# EAGLE design Test2 (EAGLE 7.6.0)
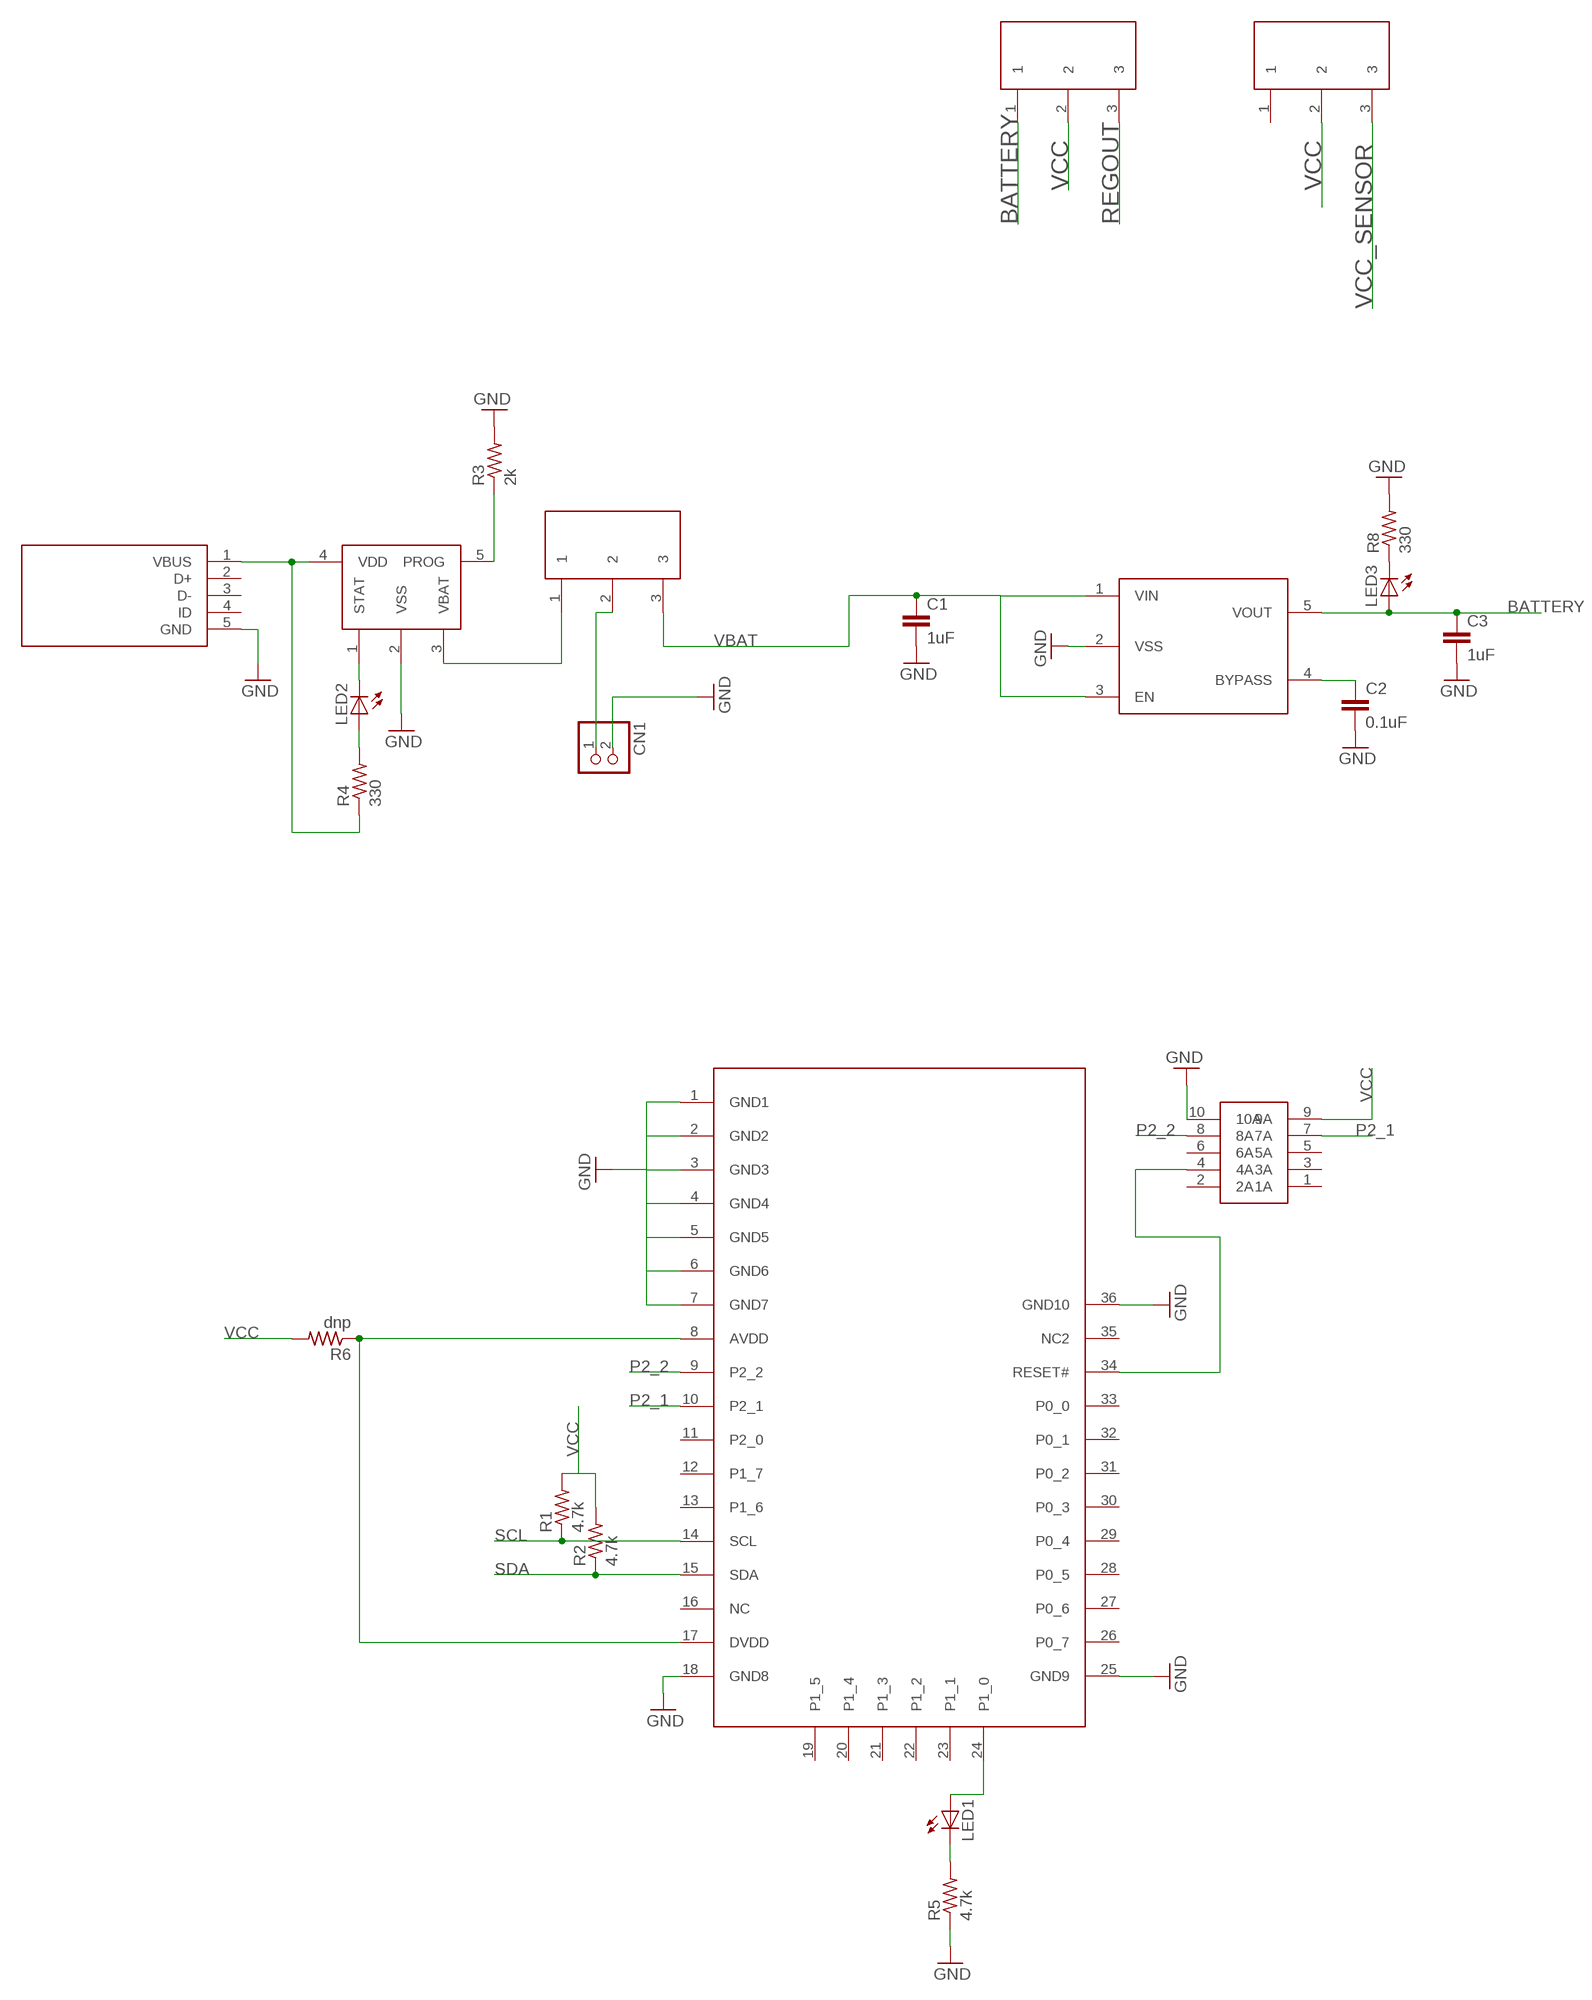
[diagram p0: schematic, sheet 1, part 1 of 2]
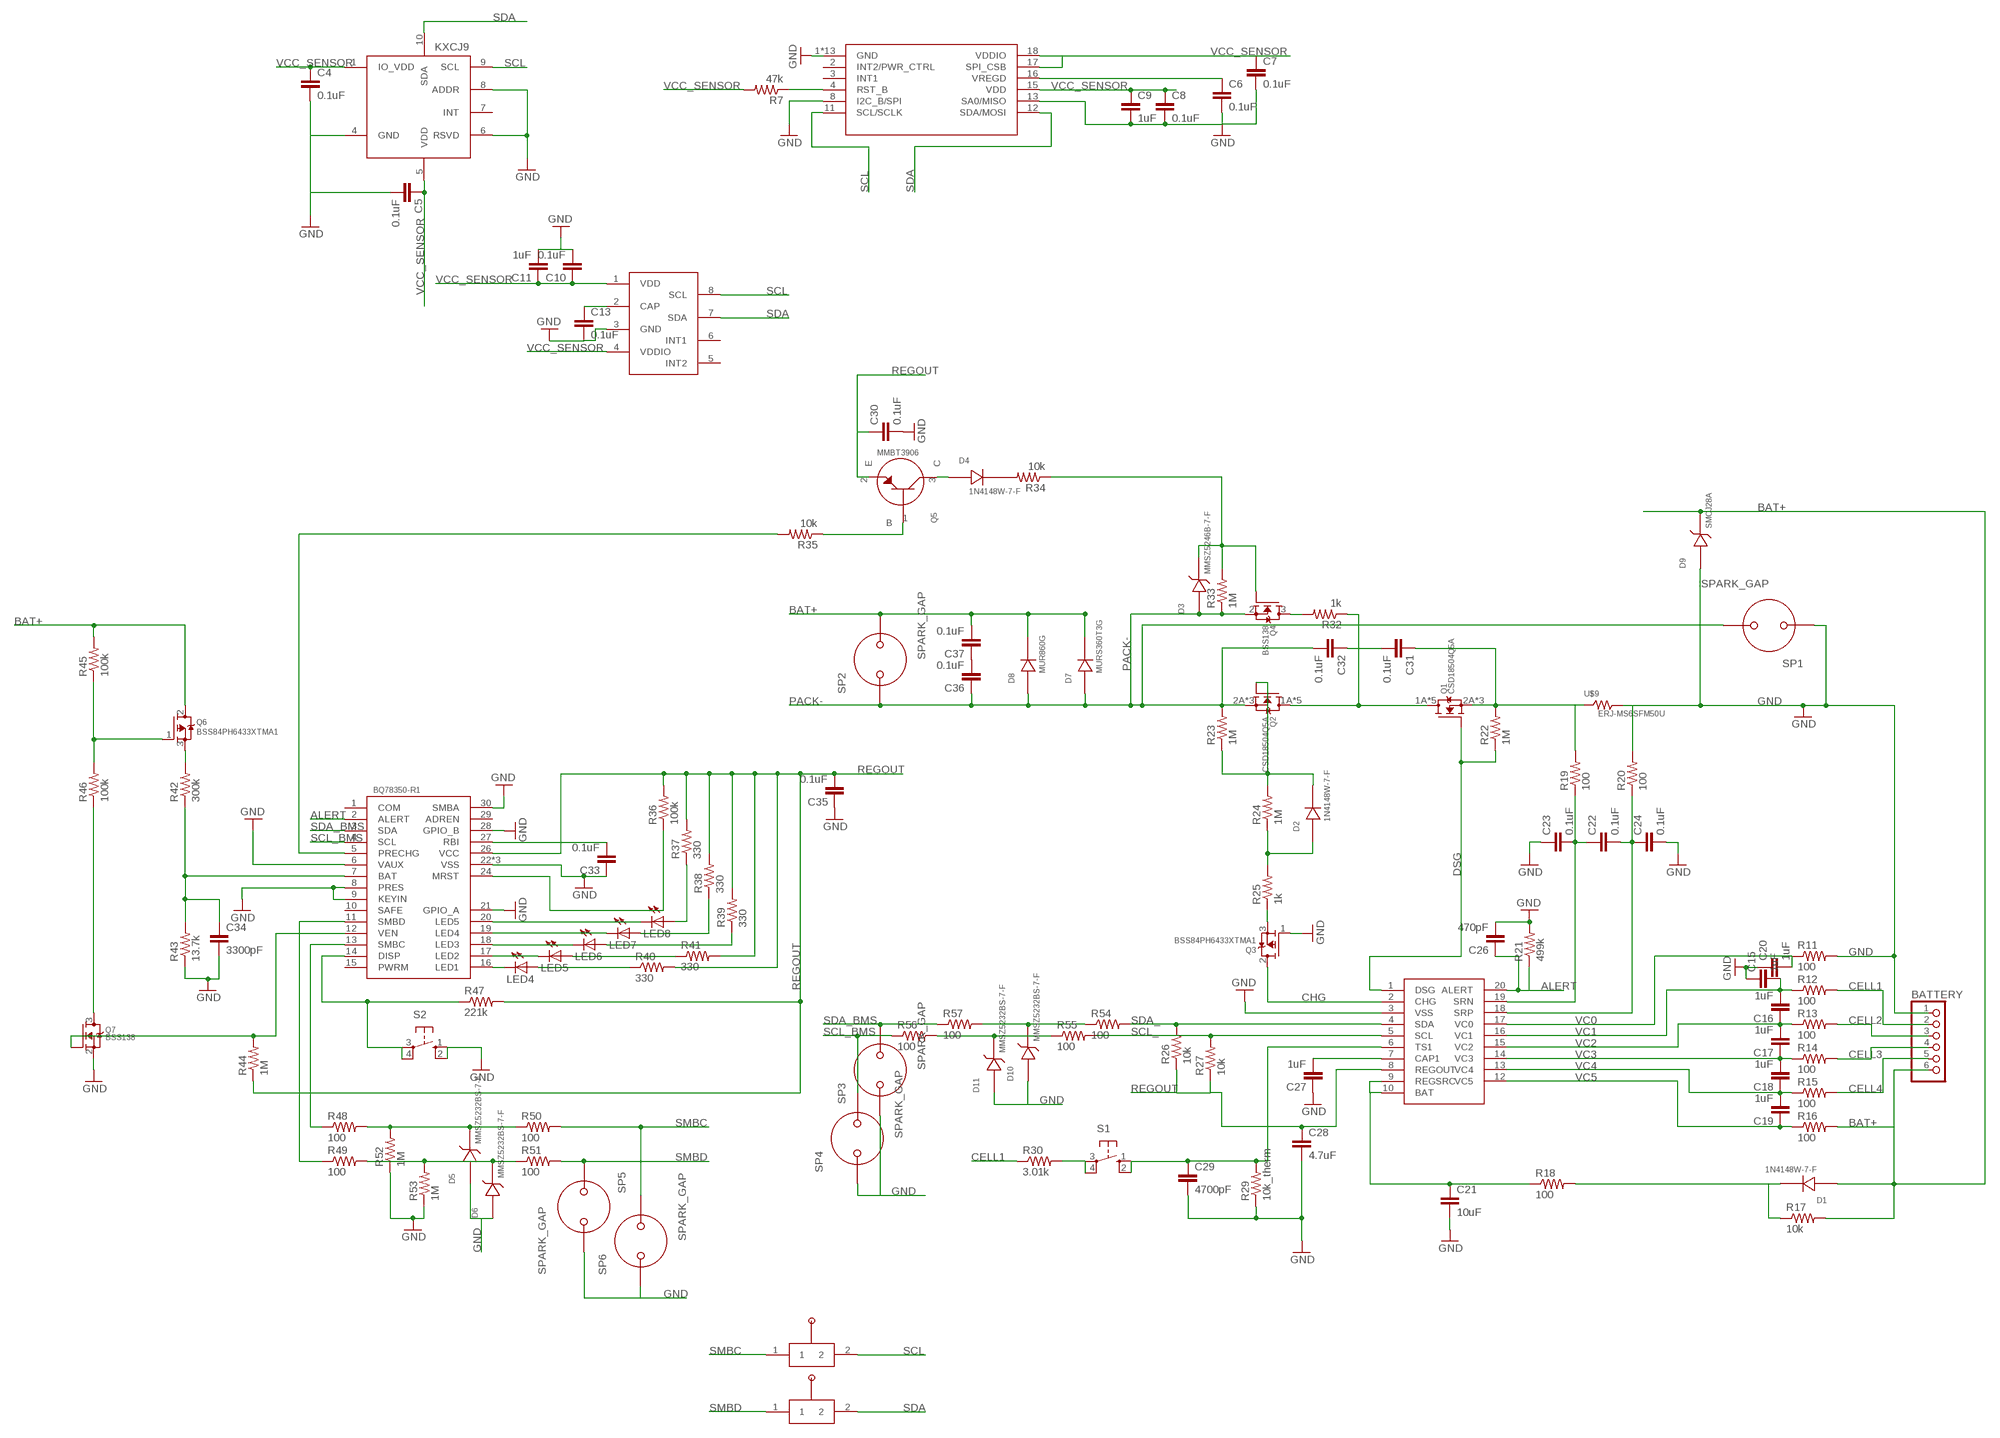
[diagram p1: schematic, sheet 1, part 2 of 2]

## Parts
BATTERY  PINHD-1X6  [1X06]
C1  1uF  C-EUC0402  [C0402]
C2  0.1uF  C-EUC0402  [C0402]
C3  1uF  C-EUC0402  [C0402]
C4  0.1uF  C-EUC0402  [C0402]
C5  0.1uF  C-EUC0402  [C0402]
C6  0.1uF  C-EUC0402  [C0402]
C7  0.1uF  C-EUC0402  [C0402]
C8  0.1uF  C-EUC0402  [C0402]
C9  1uF  C-EUC0402  [C0402]
C10  0.1uF  C-EUC0402  [C0402]
C11  1uF  C-EUC0402  [C0402]
C13  0.1uF  C-EUC0402  [C0402]
C15  1uF  C-EUC0805  [C0805]
C16  1uF  C-EUC0805  [C0805]
C17  1uF  C-EUC0805  [C0805]
C18  1uF  C-EUC0805  [C0805]
C19  1uF  C-EUC0805  [C0805]
C20  1uF  C-EUC0805  [C0805]
C21  10uF  C-EUC1206  [C1206]
C22  0.1uF  C-EUC0805  [C0805]
C23  0.1uF  C-EUC0805  [C0805]
C24  0.1uF  C-EUC0805  [C0805]
C26  470pF  C-EUC0805  [C0805]
C27  1uF  C-EUC0805  [C0805]
C28  4.7uF  C-EUC0805  [C0805]
C29  4700pF  C-EUC0402  [C0402]
C30  0.1uF  C-EUC0805  [C0805]
C31  0.1uF  C-EUC0805  [C0805]
C32  0.1uF  C-EUC0805  [C0805]
C33  0.1uF  C-EUC0805  [C0805]
C34  3300pF  C-EUC0402  [C0402]
C35  0.1uF  C-EUC0805  [C0805]
C36  0.1uF  C-EUC0805  [C0805]
C37  0.1uF  C-EUC0805  [C0805]
CN1  JST_2PIN-SMT-RA  [JST-PH-2-SMT-RA]
D1  1N4148W-7-F  [SOD-123]
D2  1N4148W-7-F  [SOD-123]
D3  MMSZ5246B-7-F  [SOD-123]
D4  1N4148W-7-F  [SOD-123]
D5  MMSZ5232BS-7-F  [SOD-323F]
D6  MMSZ5232BS-7-F  [SOD-323F]
D7  MURS360T3G  [SMC(DO-214AB)]
D8  MUR860G  [TO-220(2RA)]
D9  SMCJ28A  [SMC(DO-214AB)]
D10  MMSZ5232BS-7-F  [SOD-323F]
D11  MMSZ5232BS-7-F  [SOD-323F]
LED1  LEDCHIP-LED0805  [CHIP-LED0805]
LED2  LEDCHIP-LED0805  [CHIP-LED0805]
LED3  LEDCHIP-LED0805  [CHIP-LED0805]
LED4  LEDCHIPLED_0805  [CHIPLED_0805]
LED5  LEDCHIPLED_0805  [CHIPLED_0805]
LED6  LEDCHIPLED_0805  [CHIPLED_0805]
LED7  LEDCHIPLED_0805  [CHIPLED_0805]
LED8  LEDCHIPLED_0805  [CHIPLED_0805]
Q1  CSD18504Q5A  [Q5A]
Q2  CSD18504Q5A  [Q5A]
Q3  BSS84PH6433XTMA1  [SOT23-3]
Q4  BSS138  [SOT23-3]
Q5  MMBT3906  [SOT23-3]
Q6  BSS84PH6433XTMA1  [SOT23-3]
Q7  BSS138  [SOT23-3]
R1  4.7k  R-US_R0402  [R0402]
R2  4.7k  R-US_R0402  [R0402]
R3  2k  R-US_R0402  [R0402]
R4  330  R-US_R0402  [R0402]
R5  4.7k  R-US_R0402  [R0402]
R6  dnp  R-US_R0402  [R0402]
R7  47k  R-US_R0402  [R0402]
R8  330  R-US_R0402  [R0402]
R11  100  R-US_R1206  [R1206]
R12  100  R-US_R1206  [R1206]
R13  100  R-US_R1206  [R1206]
R14  100  R-US_R1206  [R1206]
R15  100  R-US_R1206  [R1206]
R16  100  R-US_R1206  [R1206]
R17  10k  R-US_R0805  [R0805]
R18  100  R-US_R0805  [R0805]
R19  100  R-US_R0805  [R0805]
R20  100  R-US_R0805  [R0805]
R21  499k  R-US_R0805  [R0805]
R22  1M  R-US_R1206  [R1206]
R23  1M  R-US_R1206  [R1206]
R24  1M  R-US_R1206  [R1206]
R25  1k  R-US_R0805  [R0805]
R26  10k  R-US_R0805  [R0805]
R27  10k  R-US_R0805  [R0805]
R29  10k_therm  R-US_R0402  [R0402]
R30  3.01k  R-US_R0805  [R0805]
R32  1k  R-US_R2512  [R2512]
R33  1M  R-US_R1206  [R1206]
R34  10k  R-US_R0805  [R0805]
R35  10k  R-US_R0805  [R0805]
R36  100k  R-US_R0805  [R0805]
R37  330  R-US_R0402  [R0402]
R38  330  R-US_R0402  [R0402]
R39  330  R-US_R0402  [R0402]
R40  330  R-US_R0402  [R0402]
R41  330  R-US_R0402  [R0402]
R42  300k  R-US_R0805  [R0805]
R43  13.7k  R-US_R0805  [R0805]
R44  1M  R-US_R1206  [R1206]
R45  100k  R-US_R0805  [R0805]
R46  100k  R-US_R0805  [R0805]
R47  221k  R-US_R0805  [R0805]
R48  100  R-US_R0805  [R0805]
R49  100  R-US_R0805  [R0805]
R50  100  R-US_R0805  [R0805]
R51  100  R-US_R0805  [R0805]
R52  1M  R-US_R1206  [R1206]
R53  1M  R-US_R1206  [R1206]
R54  100  R-US_R0805  [R0805]
R55  100  R-US_R0805  [R0805]
R56  100  R-US_R0805  [R0805]
R57  100  R-US_R0805  [R0805]
S1  10-XX  [B3F-10XX]
S2  10-XX  [B3F-10XX]
SP1  SPARK_GAP  [SPARK_GAP]
SP2  SPARK_GAP  [SPARK_GAP]
SP3  SPARK_GAP  [SPARK_GAP]
SP4  SPARK_GAP  [SPARK_GAP]
SP5  SPARK_GAP  [SPARK_GAP]
SP6  SPARK_GAP  [SPARK_GAP]
U$1  BQ76920  [SOIC-20]
U$2  BLE113  [BLUEGIGA]
U$3  RIBBON_10POS_MALE  [RIBBON_10POS_MALE]
U$4  LP3985  [SOT23-5L]
U$5  SPDT_THRU  [SPDT_THRU]
U$6  USB_MINI  [USB_MINI]
U$7  KXCJ9  [KXCJ9]
U$8  FXAS21002  [FXAS21002]
U$9  ERJ-MS6SFM50U  [ERJ-MS6SFM50U]
U$10  BQ78350-R1  [SOIC-30]
U$11  SPDT_THRU  [SPDT_THRU]
U$12  SPDT_THRU  [SPDT_THRU]
U$13  MCP73831  [MCP73831]
U$14  MLP3115A2  [MLP3115A2]
U$16  MANUAL_SWITCH  [MANUAL_SWITCH]
U$17  MANUAL_SWITCH  [MANUAL_SWITCH]

## Nets
ALERT: C26.1 R21.1 U$1.20(ALERT) U$10.2(ALERT)
BAT+: BATTERY.6 C37.2 D1.P$1 D7.2 D8.P$3 D9.2 Q6.2(S) R16.2 R17.2 R45.2 SP2.P$2
BATTERY: C3.1 LED3.A U$4.5(VOUT) U$11.1
CELL1: BATTERY.2 R12.2 R30.1
CELL2: BATTERY.3 R13.2
CELL3: BATTERY.4 R14.2
CELL4: BATTERY.5 R15.2
CHG: Q3.2(S) U$1.2(CHG)
DSG: Q1.3A(G) R22.1 U$1.1(DSG)
GND: BATTERY.1 C1.2 C2.2 C3.2 C4.2 C5.2 C6.2 C7.2 C8.2 C9.2 C10.2 C11.2 C13.2 C15.1 C20.1 C21.2 C23.1 C24.2 C26.2 C27.1 C28.2 C29.2 C30.2 C33.1 C34.2 C35.1 CN1.2 D5.1 D6.1 D9.1 D10.1 D11.1 Q3.1(G) Q7.2(S) R3.2 R5.1 R8.2 R11.2 R20.2 R21.2 R29.1 R43.1 R52.1 R53.1 S2.1(S) S2.2(S1) SP1.P$1 SP3.P$1 SP4.P$1 SP5.P$2 SP6.P$1 U$1.3(VSS) U$2.1(GND1) U$2.2(GND2) U$2.3(GND3) U$2.4(GND4) U$2.5(GND5) U$2.6(GND6) U$2.7(GND7) U$2.18(GND8) U$2.25(GND9) U$2.36(GND10) U$3.10(10A) U$4.2(VSS) U$6.5(GND) U$7.4(GND) U$7.6(RSVD) U$7.8(ADDR) U$8.1(GND) U$8.5(GND) U$8.6(GND) U$8.7(GND) U$8.8(I2C_B/SPI) U$8.9(GND) U$8.10(GND) U$8.13(SA0/MISO) U$8.14(GND) U$8.19(GND) U$8.20(GND) U$8.21(GND) U$8.22(GND) U$8.23(GND) U$8.24(GND) U$9.2 U$10.6(VAUX) U$10.8(PRES) U$10.9(KEYIN) U$10.21(GPIO_A) U$10.22(VSS) U$10.23(VSS) U$10.25(VSS) U$10.28(GPIO_B) U$10.30(SMBA) U$13.2(VSS) U$14.3(GND)
N$2: R6.1 U$2.8(AVDD) U$2.17(DVDD)
N$3: CN1.1 U$5.2
N$4: U$2.34(RESET#) U$3.4(4A)
N$5: R3.1 U$13.5(PROG)
N$6: U$5.1 U$13.3(VBAT)
N$7: LED2.A R4.2
N$8: LED2.C U$13.1(STAT)
N$9: LED1.C R5.2
N$10: LED1.A U$2.24(P1_0)
N$11: C2.1 U$4.4(BYPASS)
N$12: C6.1 U$8.16(VREGD)
N$13: C13.1 U$14.2(CAP)
N$14: LED3.C R8.1
N$15: C21.1 R18.1 U$1.9(REGSRC) U$1.10(BAT)
N$16: C22.2 C24.1 R20.1 U$1.18(SRP)
N$17: D1.P$2 R17.1 R18.2
N$18: D11.2 R55.1 R56.2
N$19: C31.1 Q1.2A(S) Q1.2B(S) Q1.2C(S) R19.2 R22.2 U$9.1
N$20: C22.1 C23.2 R19.1 U$1.19(SRN)
N$21: C27.2 U$1.7(CAP1)
N$22: Q4.3(D) R32.2
N$23: D4.P$2 R34.2
N$24: D3.P$2 Q4.1(G) R33.2 R34.1
N$25: D4.P$1 Q5.3(C)
N$27: D2.P$1 R24.1 R25.2
N$28: Q1.1A(D) Q1.1B(D) Q1.1C(D) Q1.1D(D) Q1.1E(D) Q2.1A(D) Q2.1B(D) Q2.1C(D) Q2.1D(D) Q2.1E(D) R32.1
N$29: C36.2 C37.1
N$30: D2.P$2 Q2.3A(G) R23.1 R24.2
N$31: Q3.3(D) R25.1
N$32: R30.2 S1.3(P) S1.4(P1)
N$33: C29.1 R29.2 S1.1(S) S1.2(S1) U$1.6(TS1)
N$34: Q5.1(B) R35.1
N$35: C31.2 C32.1
N$36: C33.2 U$10.27(RBI)
N$37: R35.2 U$10.5(PRECHG)
N$38: R36.1 U$10.24(MRST)
N$39: Q7.3(D) R46.1
N$40: LED8.C U$10.20(LED5)
N$41: LED7.C U$10.19(LED4)
N$42: LED6.C U$10.18(LED3)
N$43: LED5.C U$10.17(LED2)
N$44: LED4.C U$10.16(LED1)
N$45: LED4.A R40.1
N$46: LED5.A R41.1
N$47: LED6.A R39.1
N$48: LED7.A R38.1
N$49: LED8.A R37.1
N$50: C34.1 R42.1 R43.2 U$10.7(BAT)
N$51: Q7.1(G) R44.2 U$10.12(VEN)
N$52: Q6.3(D) R42.2
N$53: Q6.1(G) R45.1 R46.2
N$54: R48.1 U$10.13(SMBC)
N$55: R47.1 S2.3(P) S2.4(P1) U$10.14(DISP)
N$56: R49.1 U$10.11(SMBD)
N$57: D5.2 R48.2 R50.1 R52.2
N$58: D6.2 R49.2 R51.1 R53.2
N$59: D10.2 R54.1 R57.2
P2_1: U$2.10(P2_1) U$3.7(7A)
P2_2: U$2.9(P2_2) U$3.8(8A)
PACK-: C32.2 C36.1 D3.P$1 D7.1 D8.P$1 D8.P$4 Q2.2A(S) Q2.2B(S) Q2.2C(S) Q4.2(S) R23.2 R33.1 SP1.P$2 SP2.P$1
REGOUT: C28.1 C30.1 C35.2 Q5.2(E) R26.1 R27.1 R36.2 R37.2 R38.2 R39.2 R40.2 R41.2 R44.1 R47.2 U$1.8(REGOUT) U$10.26(VCC) U$11.3
RST_B: R7.1 U$8.4(RST_B)
SCL: R1.1 U$2.14(SCL) U$7.9(SCL) U$8.11(SCL/SCLK) U$14.8(SCL) U$16.2
SCL_: R27.2 R55.2 U$1.5(SCL)
SCL_BMS: R56.1 SP4.P$2 U$10.4(SCL)
SDA: R2.1 U$2.15(SDA) U$7.10(SDA) U$8.12(SDA/MOSI) U$14.7(SDA) U$17.2
SDA_: R26.2 R54.2 U$1.4(SDA)
SDA_BMS: R57.1 SP3.P$2 U$10.3(SDA)
SMBC: R50.2 SP6.P$2 U$16.1
SMBD: R51.2 SP5.P$1 U$17.1
VBAT: C1.1 U$4.1(VIN) U$4.3(EN) U$5.3
VBUS: R4.1 U$6.1(VBUS) U$13.4(VDD)
VC0: C20.2 R11.1 U$1.17(VC0)
VC1: C15.2 C16.2 R12.1 U$1.16(VC1)
VC2: C16.1 C17.2 R13.1 U$1.15(VC2)
VC3: C17.1 C18.2 R14.1 U$1.14(VC3)
VC4: C18.1 C19.2 R15.1 U$1.13(VC4)
VC5: C19.1 R16.1 U$1.12(VC5)
VCC: R1.2 R2.2 R6.2 U$3.9(9A) U$11.2 U$12.2
VCC_SENSOR: C4.1 C5.1 C7.1 C8.1 C9.1 C10.1 C11.1 R7.2 U$7.1(IO_VDD) U$7.5(VDD) U$8.15(VDD) U$8.17(SPI_CSB) U$8.18(VDDIO) U$12.3 U$14.1(VDD) U$14.4(VDDIO)
Unconnected: U$2.11(P2_0) U$2.12(P1_7) U$2.13(P1_6) U$2.16(NC) U$2.19(P1_5) U$2.20(P1_4) U$2.21(P1_3) U$2.22(P1_2) U$2.23(P1_1) U$2.26(P0_7) U$2.27(P0_6) U$2.28(P0_5) U$2.29(P0_4) U$2.30(P0_3) U$2.31(P0_2) U$2.32(P0_1) U$2.33(P0_0) U$2.35(NC2) U$3.1(1A) U$3.2(2A) U$3.3(3A) U$3.5(5A) U$3.6(6A) U$6.2(D+) U$6.3(D-) U$6.4(ID) U$7.7(INT) U$8.2(INT2/PWR_CTRL) U$8.3(INT1) U$10.1(COM) U$10.10(SAFE) U$10.15(PWRM) U$10.29(ADREN) U$12.1 U$14.5(INT2) U$14.6(INT1)

## Library data of the parts
BATTERY = adafruit:PINHD-1X6: PIN HEADER
C1-C11 C13 C15-C24 C26-C37 = rcl:C-EU: CAPACITOR, European symbol
CN1 = adafruit:JST_2PIN: JST 2-Pin Connectors of various flavors SMT-RA (S2B-PH-SM4) 4UConnector #17311 SMT (B2B-PH-SM4) THM-RA (S2B-PH) THM (B2B-PH)
D1 D2 D4 = Charles:1N4148W-7-F: DIODE GENERAL PURPOSE 100V 300MA
D3 = Charles:MMSZ5246B-7-F: ZENER DIODE 16V 500MW
D5 D6 D10 D11 = Charles:MMSZ5232BS-7-F: ZENER DIODE 5.6V 200MW
D7 = Charles:MURS360T3G: Ultrafast Power Rectifier, Diode General Purpose 600V 3A
D8 = Charles:MUR860G: DIODE GENERAL PURPOSE 600V 8A - SWITCH MODE POWER RECTIFIER
D9 = Charles:SMCJ28A: Zener Diode - 1500 Watt Transient Voltage Suppressor - 28VWM 45.4VC - Fairchild-Semiconductor
LED1-LED8 = adafruit:LED: LED OSRAM: - CHIPLED LG R971, LG N971, LY N971, LG Q971, LY Q971, LO R971, LY R971 LH N974, LH R974 LS Q976, LO Q976, LY Q976 LO Q996 - Hyper CHIPLED LW Q18S LB Q993, LB Q99A, LB R99A - SideLED LS A670, LO A670, LY A670, LG A670, LP A670 LB A673, LV A673, LT A673, LW A673 LH A674 LY A675 LS A676, LA A676, LO A676, LY A676, LW A676 LS A679, LY A679, LG A679 - Hyper Micro SIDELED® LS Y876, LA Y876, LO Y876, LY Y876 LT Y87S - SmartLED LW L88C, LW L88S LB L89C, LB L89S, LG L890 LS L89K, LO L89K, LY L89K LS L896, LA L896, LO L896, LY L896 - TOPLED LS T670, LO T670, LY T670, LG T670, LP T670 LSG T670, LSP T670, LSY T670, LOP T670, LYG T670 LG T671, LOG T671, LSG T671 LB T673, LV T673, LT T673, LW T673 LH T674 LS T676, LA T676, LO T676, LY T676, LB T676, LH T676, LSB T676, LW T676 LB T67C, LV T67C, LT T67C, LS T67K, LO T67K, LY T67K, LW E67C LS E67B, LA E67B, LO E67B, LY E67B, LB E67C, LV E67C, LT E67C LW T67C LS T679, LY T679, LG T679 LS T770, LO T770, LY T770, LG T770, LP T770 LB T773, LV T773, LT T773, LW T773 LH T774 LS E675, LA E675, LY E675, LS T675 LS T776, LA T776, LO T776, LY T776, LB T776 LHGB T686 LT T68C, LB T68C - Hyper Mini TOPLED® LB M676 - Mini TOPLED Santana® LG M470 LS M47K, LO M47K, LY M47K Source: http://www.osram.convergy.de/
Q1 Q2 = Charles:CSD18504Q5A: 40-V N-Channel NexFET Power MOSFET
Q3 Q6 = Charles:BSS84PH6433XTMA1: MOSFET P-Channel 60V 170MA SOT-23
Q4 Q7 = Charles:BSS138: MOSFET N-CH 50V 220MA
Q5 = Charles:MMBT3906: TRANSISTOR PNP 40V 0.2A
R1-R8 R11-R27 R29 R30 R32-R57 = rcl:R-US_: RESISTOR, American symbol
S1 S2 = switch-omron:10-XX: OMRON SWITCH; MPN: B3F-1000; OC_FARNELL: 176432; OC_NEWARK: 36M3542
SP1-SP6 = Charles:SPARK_GAP: Spark Gap 0.2mm ~2kV for ESD Protection
U$1 = Charles:BQ76920: 3-Series to 5-Series Cell Battery Monitor Family for Li-Ion and Phosphate Applications
U$2 = James_Updated:BLE113
U$3 = James_Updated:RIBBON_10POS_MALE
U$4 = James_Updated:LP3985
U$5 U$11 U$12 = James_Updated:SPDT_THRU
U$6 = James_Updated:USB_MINI
U$7 = Charles:KXCJ9: Tri-Axis Digital Accelerometer (2g, 4g, 8g selectable)
U$8 = Charles:FXAS21002: 3-Axis Digital Angular Rate Gyroscope (I2C/SPI)
U$9 = Charles:ERJ-MS6SFM50U: Shunt Resistor (R2526)
U$10 = Charles:BQ78350-R1: CEDV Li-Ion Gas Gauge and Battery Management Controller Companion to the BQ769x0 Battery Monitoring AFE
U$13 = Charles:MCP73831: Miniature Single-Cell, Fully Integrated Li-Ion/Li-Poly Charge Management Controller
U$14 = Charles:MLP3115A2: I2C Precision Altimeter
U$16 U$17 = James_Updated:MANUAL_SWITCH

## Board
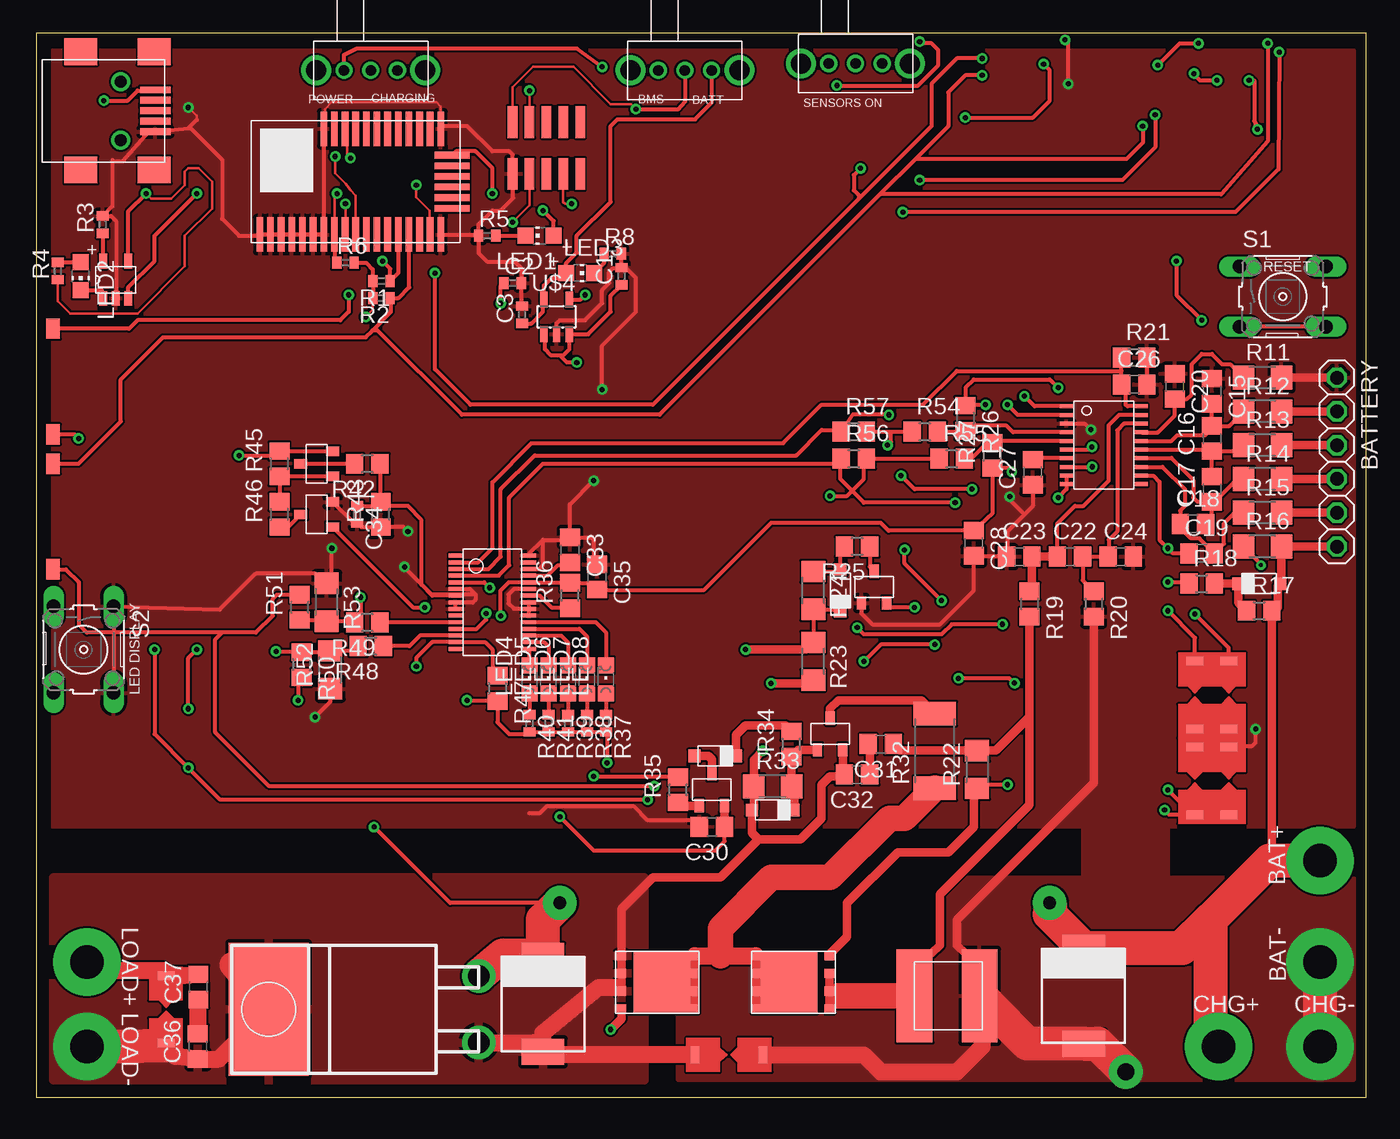
[diagram p2: board, top side]
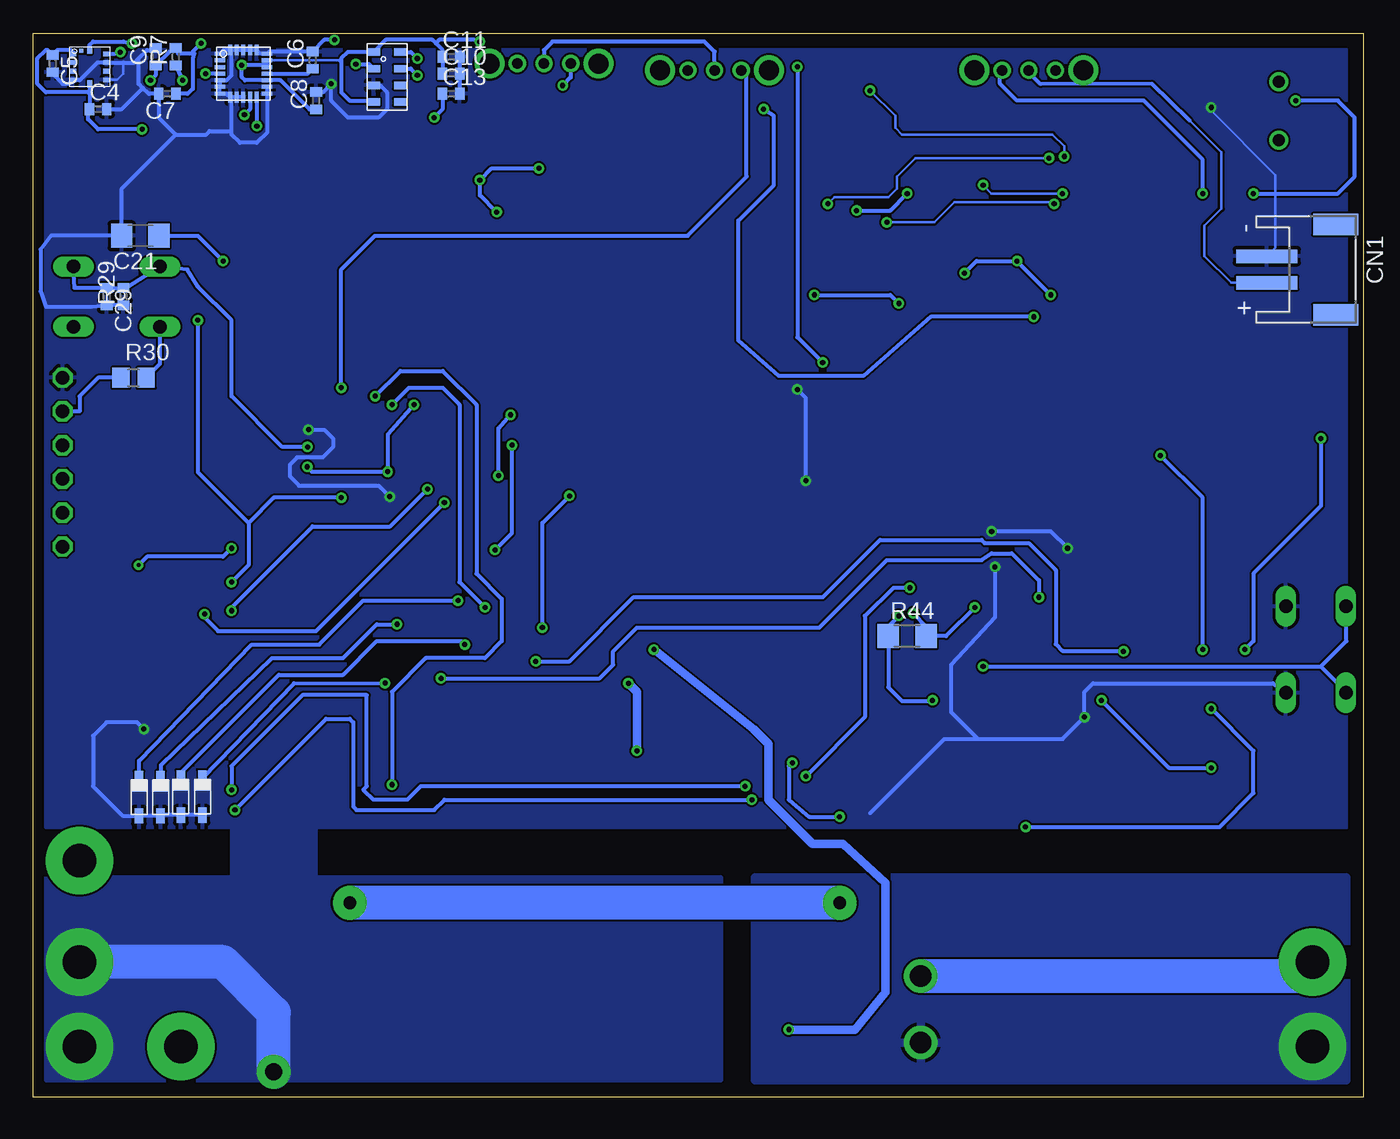
[diagram p3: board, bottom side, seen from below]

Size 100 x 80 mm. Coordinates in mm from the lower left corner, seen from the top.
Outline: 0,0 100,0 100,80 0,80 0,0
Copper layers (1*16): Top 0.035mm / dielectric 1.5mm / Bottom 0.035mm
Design rules "DRC_rules": minimum track width 8mil, minimum drill 15mil, track to track 6mil, track to pad 6mil, pad to pad 6mil, via to via 6mil, smd to smd 6mil, copper to edge 25mil, drill to drill 6mil, minimum pad ring 10mil, minimum via ring 8mil, stop-mask expansion 4mil, vias tented up to drill 0mil, thermal gap 10mil

### Footprints (pad centres in the part's own frame; a part is rotated, then mirrored left to right if it is on the bottom)
1X06 = drill 1.016 octagon: 1 -6.35,0; 2 -3.81,0; 3 -1.27,0; 4 1.27,0; 5 3.81,0; 6 6.35,0
C0402 = smd 0.7 x 0.9: 1 -0.65,0; 2 0.65,0
C0805 = smd 1.3 x 1.5: 1 -0.95,0; 2 0.95,0
C1206 = smd 1.6 x 1.8: 1 -1.4,0; 2 1.4,0
JST-PH-2-SMT-RA = smd 1 x 4.6: 1 1,-3.7; 2 -1,-3.7 | smd 1.6 x 3.4: NC1 -3.4,1.5; NC2 3.4,1.5
SOD-123 = smd 0.9 x 0.95: P$1 -1.575,0; P$2 1.575,0
SOD-323F = smd 0.65 x 1.15: 1 0,1.4; 2 0,-1.4
SMC(DO-214AB) = smd 1.96 x 3.2: 1 -3.6,0; 2 3.6,0
TO-220(2RA) = drill 1.6 pad 2.54: P$1 -2.5,0; P$3 2.5,0 | smd 10 x 6: P$4 0,15.8
CHIP-LED0805 = smd 1.2 x 1.2: A 0,-1.05; C 0,1.05
CHIPLED_0805 = smd 1.2 x 1.2: A 0,-1.05; C 0,1.05
Q5A = smd 0.66 x 0.686: 1A -2.781,1.981; 1B -2.781,0.66; 1C -2.781,-0.66; 1D -2.781,-2 | smd 4.293 x 4.648: 1E -0.305,0 | smd 0.749 x 0.686: 2A 2.75,0.66; 2B 2.75,-0.66; 2C 2.75,-1.981; 3A 2.75,1.981
SOT23-3 = smd 0.7 x 1: 1 -0.95,-1.2; 2 0.95,-1.2; 3 0,1.2
R0402 = smd 0.7 x 0.9: 1 -0.65,0; 2 0.65,0
R1206 = smd 1.6 x 1.803: 1 -1.422,0; 2 1.422,0
R0805 = smd 1.3 x 1.5: 1 -0.95,0; 2 0.95,0
R2512 = smd 1.8 x 3.2: 1 -2.8,0; 2 2.8,0
B3F-10XX = drill 1.016 long: 1 -3.251,2.261; 2 3.251,2.261; 3 -3.251,-2.261; 4 3.251,-2.261
SPARK_GAP = smd 1.27 x 0.635: P$1 0,2.54; P$2 0,-2.54
SOIC-20 = smd 0.3 x 1: 1 -2.925,-2.8; 2 -2.275,-2.8; 3 -1.625,-2.8; 4 -0.975,-2.8; 5 -0.325,-2.8; 6 0.325,-2.8; 7 0.975,-2.8; 8 1.625,-2.8; 9 2.275,-2.8; 10 2.925,-2.8; 11 2.925,2.8; 12 2.275,2.8; 13 1.625,2.8; 14 0.975,2.8; 15 0.325,2.8; 16 -0.325,2.8; 17 -0.975,2.8; 18 -1.625,2.8; 19 -2.275,2.8; 20 -2.925,2.8
BLUEGIGA = smd 2.6 x 0.5: 1 -3.975,9.6; 2 -3.975,8.8; 3 -3.975,8; 4 -3.975,7.2; 5 -3.975,6.4; 6 -3.975,5.6; 7 -3.975,4.8; 8 -3.975,4; 9 -3.975,3.2; 10 -3.975,2.4; 11 -3.975,1.6; 12 -3.975,0.8; 13 -3.975,0; 14 -3.975,-0.8; 15 -3.975,-1.6; 16 -3.975,-2.4; 17 -3.975,-3.2; 18 -3.975,-4; 25 3.975,-4; 26 3.975,-3.2; 27 3.975,-2.4; 28 3.975,-1.6; 29 3.975,-0.8; 30 3.975,0; 31 3.975,0.8; 32 3.975,1.6; 33 3.975,2.4; 34 3.975,3.2; 35 3.975,4; 36 3.975,4.8 | smd 0.5 x 2.6: 19 -2,-4.85; 20 -1.2,-4.85; 21 -0.4,-4.85; 22 0.4,-4.85; 23 1.2,-4.85; 24 2,-4.85
RIBBON_10POS_MALE = smd 0.72 x 2.4: 1 -5.08,-1.95; 2 -5.08,1.95; 3 -3.81,-1.95; 4 -3.81,1.95; 5 -2.54,-1.95; 6 -2.54,1.95; 7 -1.27,-1.95; 8 -1.27,1.95; 9 0,-1.95; 10 0,1.95
SOT23-5L = smd 0.55 x 1.2: 1 -0.95,-1.3; 2 0,-1.3; 3 0.95,-1.3; 4 0.95,1.3; 5 -0.95,1.3
SPDT_THRU = drill 0.787: 1 -2.007,0; 2 0,0; 3 2.007,0 | drill 1.499: A1 -4.102,0; A2 4.102,0
USB_MINI = smd 0.508 x 2.311: 1 -1.575,2.603; 2 -0.787,2.603; 3 0,2.603; 4 0.787,2.603; 5 1.575,2.603 | smd 2.007 x 2.489: S1 -4.445,2.515; S2 4.445,2.515; S3 -4.445,-2.997; S4 4.445,-2.997 | drill 0.914: S5 -2.197,0; S6 2.197,0
KXCJ9 = smd 0.55 x 0.35: 1 -1.275,0.975; 2 -1.275,0.325; 3 -1.275,-0.325; 4 -1.275,-0.975; 6 1.275,-0.975; 7 1.275,-0.325; 8 1.275,0.325; 9 1.275,0.975 | smd 0.35 x 0.55: 5 0,-1.275; 10 0,1.275 | smd 0.3 x 0.3: P$11 -0.65,1.2
FXAS21002 = smd 0.8 x 0.3: 1 -1.775,1.5; 2 -1.775,1; 3 -1.775,0.5; 4 -1.775,0; 5 -1.775,-0.5; 6 -1.775,-1; 7 -1.775,-1.5; 13 1.775,-1.5; 14 1.775,-1; 15 1.775,-0.5; 16 1.775,0; 17 1.775,0.5; 18 1.775,1; 19 1.775,1.5 | smd 0.3 x 0.8: 8 -1,-1.775; 9 -0.5,-1.775; 10 0,-1.775; 11 0.5,-1.775; 12 1,-1.775; 20 1,1.775; 21 0.5,1.775; 22 0,1.775; 23 -0.5,1.775; 24 -1,1.775
ERJ-MS6SFM50U = smd 2.7 x 7: 1 -2.54,0; 2 2.35,0
SOIC-30 = smd 0.3 x 1: 1 -3.5,-2.775; 2 -3,-2.775; 3 -2.5,-2.775; 4 -2,-2.775; 5 -1.5,-2.775; 6 -1,-2.775; 7 -0.5,-2.775; 8 0,-2.775; 9 0.5,-2.775; 10 1,-2.775; 11 1.5,-2.775; 12 2,-2.775; 13 2.5,-2.775; 14 3,-2.775; 15 3.5,-2.775; 16 3.5,2.775; 17 3,2.775; 18 2.5,2.775; 19 2,2.775; 20 1.5,2.775; 21 1,2.775; 22 0.5,2.775; 23 0,2.775; 24 -0.5,2.775; 25 -1,2.775; 26 -1.5,2.775; 27 -2,2.775; 28 -2.5,2.775; 29 -3,2.775; 30 -3.5,2.775
MCP73831 = smd 0.6 x 1.1: 1 -0.95,-1.4; 2 0,-1.4; 3 0.95,-1.4; 4 0.95,1.4; 5 -0.95,1.4
MLP3115A2 = smd 0.95 x 0.55: 1 -1,1.875; 2 -1,0.625; 3 -1,-0.625; 4 -1,-1.875; 5 1,-1.875; 6 1,-0.625; 7 1,0.625; 8 1,1.875
MANUAL_SWITCH = smd 1.524 x 1.016: 1 -4.13,0; 2 3.81,0

### Placement (x,y rotation side)
BATTERY  97.79,47.75 270 top
C1  43.99,61.72 90 top
C2  35.81,61.21 0 top
C3  36.53,58.83 90 top
C4  95.12,74.3 0 bottom
C5  98.55,77.72 270 bottom
C6  78.99,77.98 90 bottom
C7  89.92,75.44 180 bottom
C8  78.74,74.93 90 bottom
C9  90.81,78.23 90 bottom
C10  68.58,76.96 0 bottom
C11  68.58,78.23 0 bottom
C13  68.58,75.44 0 bottom
C15  88.39,53.09 270 top
C16  88.39,49.53 90 top
C17  88.39,45.72 90 top
C18  86.97,43.1 0 top
C19  87.63,40.89 0 top
C20  85.6,53.44 270 top
C21  91.95,64.77 180 bottom
C22  77.72,40.64 0 top
C23  73.91,40.64 0 top
C24  81.53,40.64 0 top
C26  82.55,53.59 0 top
C27  74.93,46.99 90 top
C28  70.48,41.66 270 top
C29  94.49,60.2 270 bottom
C30  50.8,20.32 180 top
C31  63.5,26.54 180 top
C32  61.72,24.26 180 top
C33  40.13,41.15 270 top
C34  24.13,43.81 270 top
C35  42.16,39.12 270 top
C36  12.14,3.81 90 top
C37  12.19,8.28 90 top
CN1  3.56,62.23 270 bottom
D1  91.95,38.61 180 top
D2  60.45,38.1 270 top
D3  55.37,21.59 0 top
D4  51.05,25.65 0 top
D5  88.9,22.61 180 bottom
D6  87.27,22.61 180 bottom
D7  38.1,7.01 90 top
D8  33.27,6.6 90 top
D9  78.74,7.62 90 top
D10  92.05,22.56 180 bottom
D11  90.42,22.56 180 bottom
LED1  37.85,64.77 90 top
LED2  3.33,61.72 180 top
LED3  40.89,61.98 270 top
LED4  37.08,31.42 0 top
LED5  38.51,31.42 0 top
LED6  39.98,31.42 0 top
LED7  41.4,31.42 0 top
LED8  42.82,31.42 0 top
Q1  56.9,8.64 0 top
Q2  46.74,8.64 180 top
Q3  62.99,38.35 0 top
Q4  59.69,27.3 0 top
Q5  50.8,23.11 0 top
Q6  21.08,47.62 90 top
Q7  21.08,43.81 90 top
R1  25.96,61.37 180 top
R2  25.96,60.1 180 top
R3  4.98,65.61 90 top
R4  1.63,62.13 90 top
R5  33.91,64.77 0 top
R6  23.24,62.74 0 top
R7  89.28,78.23 90 bottom
R8  43.33,63.42 0 top
R11  92.2,54.1 0 top
R12  92.2,51.56 0 top
R13  92.2,49.02 0 top
R14  92.2,46.48 0 top
R15  92.2,43.94 0 top
R16  92.2,41.4 0 top
R17  91.95,36.58 0 top
R18  87.63,38.61 0 top
R19  74.68,37.08 270 top
R20  79.5,37.08 270 top
R21  82.55,55.63 0 top
R22  70.74,24.64 90 top
R23  58.42,32.77 270 top
R24  58.42,38.1 270 top
R25  61.72,41.4 180 top
R26  69.85,51.05 270 top
R27  71.88,48.26 90 top
R29  93.22,60.2 90 bottom
R30  92.46,54.1 0 bottom
R32  67.56,26.04 90 top
R33  55.37,23.37 0 top
R34  56.77,26.54 90 top
R35  48.26,23.11 90 top
R36  40.13,37.72 90 top
R37  42.82,28.12 270 top
R38  41.4,28.12 270 top
R39  39.98,28.12 270 top
R40  37.08,28.12 270 top
R41  38.51,28.12 270 top
R42  24.89,47.62 180 top
R43  25.91,43.81 90 top
R44  34.29,34.67 0 bottom
R45  18.29,47.62 90 top
R46  18.29,43.81 90 top
R47  34.67,30.73 270 top
R48  25.15,33.91 180 top
R49  24.89,35.69 180 top
R50  19.94,32.51 270 top
R51  19.81,36.83 90 top
R52  22.1,32.13 90 top
R53  21.84,37.21 270 top
R54  66.8,50.04 0 top
R55  68.83,48.01 0 top
R56  61.47,48.01 0 top
R57  61.47,50.04 0 top
S1  93.73,60.2 0 top
S2  3.56,33.66 270 top
SP1  52.07,3.17 270 top
SP2  9.75,6.6 180 top
SP3  87.12,30.23 180 top
SP4  89.66,30.23 180 top
SP5  89.66,23.77 180 top
SP6  87.12,23.77 0 top
U$1  80.26,49.02 270 top
U$2  26.42,68.83 90 top
U$3  35.81,71.37 180 top
U$4  39.12,58.67 0 top
U$5  25.15,77.22 180 top
U$6  6.35,74.17 270 top
U$7  95.76,77.47 0 bottom
U$8  84.2,76.96 0 bottom
U$9  68.58,7.62 0 top
U$10  34.29,37.21 270 top
U$11  48.77,77.22 180 top
U$12  61.59,77.72 180 top
U$13  5.97,61.47 0 top
U$14  73.41,76.71 0 bottom
U$16  1.27,53.98 90 top
U$17  1.27,43.81 90 top

### Tracks (layer width: path | path; a pad name or v marks a point on that pad's centre or on a via)
ALERT
  Top 0.305: 81.6,54.61 C26.1 81.92,53.28 81.92,52.07 82.04,51.95 U$1.20 | 81.6,54.61 R21.1 | U$10.2 33.23,40.21 34.29,41.27 34.29,46.23 37.24,49.17 56.16,49.17 59.05,52.07 66.67,52.07 69.22,54.61 81.6,54.61
BAT+  (via drill 0.38 pad 0.3, 0.95 pad 2.54, 2.54 pad 5.08)
  Top 0.305: Q6.2 R45.2 17.97,48.26 v15.24,48.26 | v39.37,14.61 31.11,14.61 v25.4,20.32 | v11.43,29.21 11.43,33.02 v12.06,33.66
  Top 0.635: BATTERY.6 R16.2 93.62,38.71 D1.P$1 93.34,38.43 93.34,36.83 93.09,36.58 R17.2 92.9,17.97 92.71,17.78
  Top 1.27: v3.81,10.16 3.17,9.53 9.47,9.53 SP2.P$2 11.09,9.14 C37.2
  Top 2.54: v96.52,17.78 92.71,17.78 88.27,13.34 | 88.27,13.34 88.27,3.17 v88.9,3.81 | 88.27,13.34 86.15,11.22 D9.2 76.2,13.76 v76.2,14.61 | D8.P$3 35.09,10.66 D7.2 38.1,13.34 v39.37,14.61
  Bottom 0.305: v25.4,20.32 10.79,20.32 8.26,22.86 8.26,26.04 v11.43,29.21 | v12.06,33.66 12.06,45.09 v15.24,48.26
  Bottom 2.54: D8.P$3 3.6,9.1 v3.81,10.16 | v39.37,14.61 v76.2,14.61
BATTERY
  Top 0.305: C3.1 37.22,58.18 38.1,59.05 38.1,59.91 U$4.5 38.17,61.03 38.73,61.59 39.46,61.59 LED3.A 39.84,62.7 40.64,63.5 40.64,64.77 43.18,67.31 43.18,73.03 43.69,73.53 49.53,73.53 50.8,74.8 50.8,77.7 U$11.1
CELL1
  Top 0.635: R12.2 BATTERY.2
  Bottom 0.305: R30.1 95.12,54.1 96.52,52.7 96.52,51.56 BATTERY.2
CELL2
  Top 0.635: R13.2 BATTERY.3
CELL3
  Top 0.635: R14.2 BATTERY.4
CELL4
  Top 0.635: R15.2 BATTERY.5
CHG  (via drill 0.38 pad 0.3)
  Top 0.305: U$1.2 73.8,51.3 v73.03,52.07 | v66.04,36.83 64.27,36.83 Q3.2
  Bottom 0.305: v73.03,52.07 71.75,53.34 69.22,53.34 67.94,52.07 67.94,38.73 v66.04,36.83
DSG  (via drill 0.38 pad 0.3)
  Top 0.305: U$1.1 75.05,51.95 v74.3,52.7 | v73.03,23.5 71.02,23.5 R22.1
  Top 0.635: Q1.3A 59.65,10.75 60.96,12.06 60.96,14.61 64.77,18.41 68.58,18.41 70.48,20.32 70.48,22.96 R22.1 70.76,23.22 71.12,22.86
  Bottom 0.305: v74.3,52.7 72.39,54.61 69.22,54.61 66.67,52.07 66.67,39.37 64.77,37.47 64.77,34.29 66.04,33.02 70.48,33.02 73.03,30.48 v73.03,23.5
GND  (via drill 0.38, 0.38 pad 0.3, 1.27 pad 2.54, 2.54 pad 5.08)
  Top 0.203: U$2.25 30.42,74.49 30.1,74.8 22.23,74.8 21.72,74.3 21.72,72.91 U$2.36 | 12.06,73.48 12.06,73.79 v11.43,74.42
  Top 0.305: R21.2 C26.2 83.75,53.34 | Q7.2 23.88,43.16 C34.2 24.43,42.87 R43.1 27.62,42.87 v27.94,42.55 | v22.23,41.27 22.23,39.01 R53.1 21.69,38.63 20.95,39.37 16.51,39.37 13.79,36.65 S2.1 S2.2 | C27.1 74.93,44.45 74.3,43.81 | 74.3,43.81 73.03,42.55 73.03,40.7 C23.1 70.55,40.64 C28.2 70.48,38.1 67.94,35.56 62.87,35.56 62.04,36.38 Q3.1 | C33.1 41.72,42.1 41.91,41.91 41.91,40.32 C35.1 | R52.1 22.1,29.72 v20.95,28.57 | U$10.30 37.06,40.88 38.1,41.91 | 38.1,41.91 39.94,41.91 C33.1 | U$10.28 37.81,39.71 38.1,40.01 38.1,41.91 | U$10.9 U$10.8 31.54,37.19 32.82,37.19 33.02,37.39 33.02,37.8 | U$10.6 32.6,38.21 33.02,37.8 | U$10.21 U$10.22 | U$10.22 U$10.23 | U$10.25 35.92,38.21 35.51,37.8 35.51,37.13 35.92,36.73 37.05,36.73 U$10.22 | C3.2 36.46,59.54 C2.2 36.47,61.22 36.47,62.33 35.97,62.84 33.88,62.84 33.26,63.46 R5.1 | R8.2 43.98,62.38 C1.2 | U$2.18 33.17,64.86 R5.1 | R5.1 33.26,65.64 34.29,66.67 34.92,66.67 35.87,67.61 35.87,69.37 U$3.10 35.81,70.87 35.56,71.12 34.29,71.12 32.38,73.03 30.63,73.03 U$2.25 | U$2.36 U$2.7 U$2.6 U$2.5 U$2.4 U$2.3 U$2.2 U$2.1 16.73,64.77 15.24,64.77 13.97,66.04 13.97,70.48 11.61,72.85 11.43,72.85 | 11.43,72.85 U$6.5 8.46,72.59 6.48,70.36 5.84,70.36 5.71,70.48 5.71,67 R3.2 5.62,66.26 5.99,65.89 5.99,60.6 U$13.2 | 12.06,73.48 11.43,72.85 | U$4.2 39.12,58.17 39.37,58.42 41.27,58.42 42.55,59.69 42.55,60.68 43.08,61.21 43.08,62.03 43.38,62.33 43.95,62.33 C1.2 | C33.1 40.13,44.58 v41.91,46.35 | v42.55,53.21 42.55,56.52 45.09,59.05 45.09,61.59 44.45,62.23 44.13,62.23 C1.2 | v77.6,76.2 77.6,79.25 v77.34,79.5 | U$1.3 78.84,50.65 v79.3,50.19 | v73.2,45.16 73.2,44.91 74.3,43.81
  Top 0.305: 33.02,37.8 29.72,37.8 27.69,39.83 v27.69,39.88 | 89.66,26.42 SP4.P$1 SP3.P$1 SP6.P$1 87.22,26.42 89.66,26.42 | 89.66,26.42 SP5.P$2 | 89.66,26.42 91.44,26.42 91.69,26.67 v91.69,27.69 | C30.2 49.34,20.83 45.97,20.83 44.96,21.84 38.35,21.84 37.85,21.34 37.08,21.34
  Top 0.635: R20.2 79.5,23.62 69.22,13.34 69.22,11.43 69.85,10.79 70.48,10.79 71.12,10.16 71.12,7.81 U$9.2 | R11.2 BATTERY.1
  Top 1.27: SP1.P$1 62.23,3.17 63.5,1.91 69.22,1.91 71.12,3.81 71.12,6.35 71.66,6.89
  Top 2.54: v96.52,10.16 v96.52,3.81 | U$9.2 71.66,6.89 74.53,4.02 D9.1 79.8,4.02 v81.92,1.91
  Bottom 0.203: v11.43,74.42 11.43,74.17 6.6,69.34 6.6,63.88 CN1.2 | U$7.6 93.69,76.5 93.22,76.96 93.22,77.8
  Bottom 0.305: v22.23,41.27 23.5,42.55 v27.94,42.55 | S2.2 6.78,31.11 20.32,31.11 20.95,30.48 v20.95,28.57 22.61,26.92 28.96,26.92 | v41.91,46.35 41.91,52.58 v42.55,53.21 | R29.1 C29.2 95.62,59.44 99.06,59.44 99.44,60.58 99.44,63.75 98.68,64.77 C21.2 93.35,68.32 89.28,72.39 | C11.2 C10.2 C13.2 | U$8.14 U$8.13 82.43,72.51 83.19,71.75 84.45,71.75 85.09,72.39 85.09,72.64 | U$8.10 U$8.9 U$8.8 | U$8.8 85.48,75.46 U$8.7 U$8.6 U$8.5 85.46,76.46 85.09,76.83 85.09,78.63 U$8.24 | U$8.24 85.7,78.74 U$8.1 | U$8.24 U$8.23 U$8.22 U$8.21 U$8.20 82.93,78.46 U$8.19 82.26,78.63 C6.2 78.12,79.5 v77.34,79.5 | 85.09,72.64 85.09,75.08 U$8.8 | 91.76,75.88 91.31,75.44 C7.2 90.55,75.42 90.55,73.66 89.28,72.39 | 91.76,75.88 92.08,76.2 92.08,78.11 | 92.08,78.11 91.44,78.74 90.95,78.74 C9.2 | C4.2 93.34,74.3 91.76,75.88 | C5.2 98.55,76.96 97.79,76.2 97.33,76.2 U$7.4 96.99,76.45 96.52,76.45 95.18,77.8 U$7.8 93.22,77.8 92.39,77.8 92.08,78.11 | C8.2 78.22,75.58 v77.6,76.2 77.6,74.93 76.33,73.66 74.04,73.66 73.41,74.3 73.41,75.56 73.92,76.08 U$14.3 | 89.28,72.39 87,72.39 86.74,72.64 85.09,72.64 | v79.3,50.19 78.13,50.19 77.47,49.53 77.47,48.87 78.23,48.11 80.16,48.11 80.72,47.55 80.72,46.69 80.01,45.97 74.02,45.97 v73.2,45.16 | v27.69,39.88 27.69,36.07 30.99,32.51 30.99,28.96 28.96,26.92 | D6.1 D5.1 90.37,21.21 D11.1 D10.1 93.29,21.16 95.5,23.37 95.5,27.18 94.49,28.19 92.2,28.19 v91.69,27.69 | 37.08,21.34 31.5,26.92 28.96,26.92
  Bottom 2.54: v96.52,10.16 85.72,10.16 81.92,6.35 v81.92,1.91
  pour Top: 48.26,16.51 78.74,16.51 78.74,20.32 1.27,20.32 1.27,78.74 99.06,78.74 99.06,20.32 85.09,20.32 85.09,16.51 99.06,16.51 99.06,1.27 48.26,1.27
  pour Bottom: 48.26,16.51 78.74,16.51 78.74,20.32 1.27,20.32 1.27,78.74 99.06,78.74 99.06,20.32 85.09,20.32 85.09,16.51 99.06,16.51 99.06,1.27 48.26,1.27
N$2  (via drill 0.38 pad 0.3)
  Top 0.203: U$2.8 22.42,67.75 v22.61,67.94 | v28.57,68.58 28.57,67.69 29.59,66.67 29.59,64.88 U$2.17
  Top 0.305: U$2.8 22.42,62.91 R6.1
  Bottom 0.203: v22.61,67.94 27.94,67.94 v28.57,68.58
N$3
  Bottom 0.203: CN1.1 9.92,61.23 11.94,63.25 11.94,65.53 10.67,66.8 10.67,71.04 13.07,73.45
  Bottom 0.305: 13.07,73.45 15.88,76.2 24.26,76.17 25.2,77.11 25.2,77.67 U$5.2
N$4  (via drill 0.38 pad 0.3)
  Top 0.203: U$2.34 23.22,72.8 23.37,72.64 23.37,70.87 v23.62,70.61 | v40.26,67.18 39.75,67.18 39.62,67.31 U$3.4
  Bottom 0.203: v23.62,70.61 33.66,70.61 35.05,69.22 35.05,68.33 35.69,67.69 39.75,67.69 v40.26,67.18
N$5
  Top 0.305: U$13.5 5.02,64.92 R3.1
N$6  (via drill 0.38 pad 0.3)
  Top 0.305: U$13.3 6.92,60.89 8.89,62.87 8.89,64.77 v12.06,67.94
  Bottom 0.305: v12.06,67.94 12.06,70.48 16.51,74.93 26.04,74.93 27.3,76.2 27.3,77.57 U$5.1
N$7
  Top 0.305: R4.2 LED2.A
N$8
  Top 0.305: LED2.C 4.92,60.67 U$13.1
N$9
  Top 0.305: R5.2 LED1.C
N$10  (via drill 0.38 pad 0.3)
  Top 0.305: LED1.A 38.9,65.88 v38.1,66.67 | v34.29,67.94 34.29,69.85 33.02,71.12 31.55,71.12 U$2.24
  Bottom 0.305: v38.1,66.67 35.56,66.67 v34.29,67.94
N$11  (via drill 0.38 pad 0.3)
  Top 0.305: U$4.4 40.92,59.97 v41.27,60.33 | v34.92,59.69 34.92,60.98 C2.1
  Bottom 0.305: v41.27,60.33 35.56,60.33 v34.92,59.69
N$12
  Bottom 0.305: U$8.16 79.36,76.96 C6.1
N$13  (via drill 0.38 pad 0.3)
  Top 0.305: v69.85,73.66 74.93,73.66 76.2,74.93 76.2,77.22 v75.74,77.67
  Bottom 0.305: C13.1 69.23,74.28 v69.85,73.66 | v75.74,77.67 74.75,77.67 U$14.2
N$14
  Top 0.305: R8.1 42.68,62.71 LED3.C
N$15  (via drill 0.38 pad 0.3)
  Top 0.305: U$1.9 U$1.10 77.46,45.71 v76.83,45.09 | v85.09,38.73 86.55,38.73 R18.1 | v85.72,62.87 85.72,60.33 v87.63,58.42
  Bottom 0.305: v76.83,45.09 81.92,45.09 83.82,43.18 | 83.82,43.18 83.82,40.01 v85.09,38.73 | C21.1 87.63,64.77 v85.72,62.87 | v87.63,58.42 87.63,46.99 83.82,43.18
N$16
  Top 0.305: R20.1 78.67,38.86 C22.2 C24.1 80.64,40.7 80.64,41.91 81.28,42.55 81.28,50.14 81.79,50.65 U$1.18
N$17
  Top 0.635: R17.1 90.37,37.2 D1.P$2 R18.2
N$18  (via drill 0.38)
  Top 0.305: R55.1 R56.2 62.23,47.82 62.23,46.48 60.96,45.21 v59.69,45.21 | v72.64,35.56 68.83,35.56 68.07,34.8 62.23,34.8 v61.72,35.31
  Bottom 0.305: v61.72,35.31 61.72,43.18 v59.69,45.21 | D11.2 90.4,24.97 82.04,33.02 76.71,33.02 74.17,35.56 v72.64,35.56
N$19
  Top 0.635: Q1.2B Q1.2C | Q1.2B Q1.2A | 60.33,7.62 60,7.62 Q1.2B | C31.1 64.93,26.06 R22.2 72.16,26.06 74.68,28.57 | R19.2 74.68,28.57 | 74.68,28.57 74.68,21.97 67.94,15.24 67.94,11.43 67.31,10.79 66.67,10.79 66.04,10.16 U$9.1
  Top 1.905: U$9.1 60.33,7.62
N$20
  Top 0.305: C22.1 76.77,43.12 78.11,44.45 78.74,44.45 80.64,46.35 80.64,50.52 81.43,51.31 U$1.19
  Top 0.635: R19.1 74.86,38.22 C23.2 C22.1
N$21
  Top 0.305: U$1.7 75.04,48.05 C27.2
N$22
  Top 0.635: Q4.3 59.69,29.21 60.33,29.84 66.55,29.84 R32.2
N$23
  Top 0.635: D4.P$2 52.63,27.23 53.34,27.94 56.32,27.94 R34.2
N$24
  Top 0.635: D3.P$2 57.02,21.66 57.02,23.14 R33.2 56.79,25.18 R34.1 57.28,26.11 Q4.1
N$25
  Top 0.635: D4.P$1 50.55,25.65 50.8,25.4 Q5.3
N$27
  Top 0.305: R24.1 60.3,39.52 D2.P$1 60.45,41.08 R25.2
N$28
  Top 0.635: Q2.1D 49.52,10.78 49.53,10.79 49.53,9.53 | 49.53,9.53 Q2.1C | Q2.1C | Q2.1C 47.7,9.3 Q2.1E | Q2.1C 49.52,9.51 49.53,9.53 | Q2.1C Q2.1B Q2.1A | Q1.1A Q1.1B | Q1.1B 55.93,9.3 Q1.1E | Q1.1B Q1.1C Q1.1D
  Top 1.27: Q2.1D 51.44,10.64 54.1,10.64 Q1.1A
  Top 1.905: 51.44,10.64 51.44,12.7 55.24,16.51 59.69,16.51 64.14,20.95 65.28,20.95 R32.1
N$29
  Top 1.27: C36.2 C37.1
N$30  (via drill 0.38 pad 0.3)
  Top 0.305: D2.P$2 60.3,36.68 R24.2 R23.1
  Top 0.635: Q2.3A 43.99,5.89 v43.18,5.08 | v53.34,33.66 57.89,33.66 R23.1
  Bottom 0.635: v43.18,5.08 38.23,5.08 35.94,7.87 35.94,16.13 39.12,19.05 41.4,19.05 44.7,22.35 44.7,26.54 45.85,27.69 v53.34,33.66
N$31
  Top 0.305: R25.1 62.67,39.87 Q3.3
N$32
  Top 0.305: S1.4 S1.3
  Bottom 0.305: S1.3 90.47,55.13 R30.2
N$33  (via drill 0.38 pad 0.3)
  Top 0.305: U$1.6 79.18,48.7 v79.38,48.9
  Bottom 0.305: S1.2 96.89,60.85 C29.1 R29.2 92.88,60.94 S1.1 88.42,62.23 87.63,60.96 85.09,58.42 85.09,52.7 81.28,48.9 v79.38,48.9
N$34
  Top 0.635: Q5.1 48.51,21.91 R35.1
N$35
  Top 0.635: C32.1 62.67,26.42 C31.2
N$36
  Top 0.305: U$10.27 38.45,39.21 39.24,40.01 39.94,40.01 C33.2
N$37  (via drill 0.38 pad 0.3)
  Top 0.305: U$10.5 33.68,38.71 v34.09,38.3 | v41.91,24.13 48.19,24.13 R35.2
  Top 0.635: R35.2 48.26,24.13
  Bottom 0.305: v34.09,38.3 35.31,38.3 37.47,36.2 37.47,28.57 v41.91,24.13
N$38
  Top 0.305: U$10.24 37.85,37.71 38.73,36.83 40.07,36.83 R36.1
N$39
  Top 0.305: R46.1 18.93,42.87 Q7.3
N$40
  Top 0.305: U$10.20 42.06,35.71 42.82,34.95 LED8.C
N$41
  Top 0.305: U$10.19 40.84,35.21 41.4,34.65 LED7.C
N$42
  Top 0.305: U$10.18 39.46,34.71 39.98,34.19 LED6.C
N$43
  Top 0.305: U$10.17 38.18,34.21 38.51,33.88 LED5.C
N$44
  Top 0.305: U$10.16 37.06,32.49 LED4.C
N$45
  Top 0.305: LED4.A R40.1
N$46
  Top 0.305: LED5.A R41.1
N$47
  Top 0.305: LED6.A R39.1
N$48
  Top 0.305: LED7.A R38.1
N$49
  Top 0.305: LED8.A R37.1
N$50
  Top 0.305: C34.1 25.61,44.47 R43.2 | R43.2 25.91,47.56 R42.1 | U$10.7 29.78,37.71 28.96,38.53 28.96,43.38 27.94,44.45 26.22,44.45 R43.2
N$51  (via drill 0.38 pad 0.3)
  Top 0.305: U$10.12 33.12,35.2 33.83,35.92 v33.83,36.37 | Q7.1 28.32,36.83 v29.21,36.83
  Bottom 0.305: v33.83,36.37 32.87,35.41 R44.2 31.37,34.67 v29.21,36.83
N$52
  Top 0.305: Q6.3 R42.2
N$53
  Top 0.305: Q6.1 R45.1 R46.2
N$54
  Top 0.305: U$10.13 31.5,34.7 28.85,34.7 28.07,33.91 R48.1
N$55  (via drill 0.38 pad 0.3)
  Top 0.305: R47.1 34.29,32.06 34.29,33.66 33.73,34.21 U$10.14 29.77,34.21 28.57,33.02 v28.57,32.38
  Bottom 0.305: v28.57,32.38 3.17,32.38 | 3.17,32.38 1.27,34.29 1.27,36.63 S2.3 | S2.4 1.29,30.5 3.17,32.38
N$56
  Top 0.305: R49.1 25.87,35.71 U$10.11
N$57  (via drill 0.38)
  Top 0.305: R48.2 23.84,33.55 R52.2 22.01,33.46 R50.1 19.87,33.53 v18.03,33.53 | v67.56,34.04 63.5,34.04 v62.23,32.77
  Bottom 0.305: D5.2 88.9,24.38 81.53,31.75 76.71,31.75 74.17,34.29 67.82,34.29 v67.56,34.04 | v62.23,32.77 59.69,32.77 54.86,37.59 40.64,37.59 36.32,41.91 28.7,41.91 28.45,41.66 25.15,41.66 23.11,39.62 23.11,34.06 22.61,33.55 18.06,33.55 v18.03,33.53
N$58  (via drill 0.38)
  Top 0.305: 19.22,35.88 R51.1 21.75,35.88 R53.2 23.84,35.79 R49.2 24.38,36.13 v24.38,37.59 | v73.56,31.14 73.15,31.5 v69.34,31.5
  Bottom 0.305: D6.2 80.39,31.12 v73.56,31.14 | v69.34,31.5 57.4,31.5 56.39,32.51 56.39,33.53 54.61,35.31 40.89,35.31 35.81,40.39 28.7,40.39 27.94,40.89 26.42,40.89 24.38,38.86 v24.38,37.59
N$59  (via drill 0.38)
  Top 0.305: R57.2 64.26,50.04 | 64.26,50.04 R54.1 | v68.07,37.34 65.28,40.13 v65.28,41.15 | v64.01,49.02 64.26,49.28 64.26,50.04
  Bottom 0.305: D10.2 92.05,25.3 83.57,34.04 78.49,34.04 75.18,37.34 v68.07,37.34 | v65.28,41.15 64.01,42.42 v64.01,49.02
P2_1  (via drill 0.38 pad 0.3)
  Top 0.203: U$2.10 24.02,67.81 23.62,68.2 23.24,68.71 22.48,69.47 v22.48,70.74 | v37.08,75.69 U$3.7
  Bottom 0.203: v22.48,70.74 22.48,71.5 23.37,72.39 34.67,72.39 35.18,72.9 35.18,73.79 v37.08,75.69
P2_2  (via drill 0.38 pad 0.3)
  Top 0.203: U$3.8 37.08,67.06 v35.81,65.79 | v23.24,67.18 23.24,64.88 U$2.9
  Bottom 0.203: v35.81,65.79 32.26,65.79 30.73,67.31 23.37,67.31 v23.24,67.18
PACK-  (via drill 0.38 pad 0.64, 2.54 pad 5.08)
  Top 0.127: 43.71,8.26 Q2.2A
  Top 0.635: Q2.2A Q2.2B Q2.2C 43.99,14.14 46.35,16.51 51.44,16.51 54.29,19.37 | Q4.2 60.64,24.39 C32.2 60.65,24.13 59.69,24.13 59.05,23.5 59.05,20.95 57.47,19.37 54.29,19.37 | 53.8,23.21 R33.1 | 54.29,19.37 53.8,19.86 D3.P$1 53.95,21.74 R33.1 | R33.1 53.95,25.38 v54.61,26.04 | v55.24,31.11 58.19,31.11 R23.2
  Top 1.27: D8.P$1 37.41,4.1 D7.1 | D7.1 38.1,4.83 42.29,8.26 43.71,8.26 | SP1.P$2 38.34,3.17 D7.1 | D8.P$4 13.73,2.86 C36.1 10.45,3.06 9.63,3.89
  Top 1.905: 14.73,9.96 D8.P$4
  Top 2.54: v3.81,3.81 6.45,3.81 9.63,3.89 SP2.P$1
  Bottom 0.635: v54.61,26.04 54.61,30.48 v55.24,31.11
  pour Top: 1.27,16.51 45.72,16.51 45.72,1.27 1.27,1.27
  pour Bottom: 1.27,16.51 45.72,16.51 45.72,1.27 1.27,1.27
REGOUT  (via drill 0.38, 0.38 pad 0.3)
  Top 0.305: U$1.8 v79.4,47.4 | v73.36,47.04 73.09,47.31 R27.1 71.88,43.88 C28.1 64.07,42.61 63.5,43.18 55.24,43.18 50.16,38.1 42.23,38.1 C35.2 41.66,38.67 R36.2 40.09,38.71 U$10.26 37.04,38.73 35.56,38.73 34.92,38.1 v34.92,36.2 | R26.1 69.92,52.07 | 69.92,52.07 v71.37,52.07 | v32.38,29.84 34.61,29.84 R47.2 34.67,28.19 35.56,27.3 36.92,27.3 R40.2 R41.2 R39.2 R38.2 R37.2 42.93,27.37 v42.93,25.15 | 69.92,52.07 69.92,53.41 70.48,53.98 76.2,53.98 v76.83,53.34 | v39.37,21.08 41.91,18.54 51.05,18.54 51.75,19.24 C30.1
  Top 0.635: Q5.2 C30.1
  Bottom 0.305: v79.4,47.4 79.05,47.04 v73.36,47.04 73.36,49.84 v71.37,52.07 | v32.38,29.84 32.45,29.78 R47.2 35.71,30.82 R44.1 35.76,35.33 v34.92,36.2 | v76.83,53.34 76.83,62.23 74.3,64.77 50.8,64.77 46.35,69.22 46.35,77.32 U$11.3 | v42.93,25.15 43.18,24.89 43.18,22.35 41.66,21.08 v39.37,21.08
RST_B  (via drill 0.38 pad 0.3)
  Top 0.305: v87.05,76.96 87.5,76.45 v88.77,76.45
  Bottom 0.305: U$8.4 v87.05,76.96 | v88.77,76.45 89.14,77.33 R7.1
SCL  (via drill 0.38 pad 0.3)
  Top 0.305: U$2.14 27.22,61.97 R1.1 26.61,62.29 v26.04,62.87 | v23.5,60.33 23.5,59.05 22.86,58.42 7.62,58.42 6.99,57.78 U$16.2 | v71.12,78.11 69.22,78.11 67.31,76.2 67.31,73.03 61.85,67.56 | v84.12,73.86 84.12,71.42 81.66,68.96 v66.42,68.96 | v93.45,78.59 93.4,69.77 90.17,66.55 v65.15,66.55 | 61.85,67.56 46.35,52.07 32.64,52.07 29.97,54.74 v29.97,61.98 | v61.98,69.85 61.47,69.34 61.47,68.2 61.85,67.82 61.85,67.56
  Bottom 0.305: v23.5,60.33 v26.04,62.87 29.08,62.87 v29.97,61.98 | U$14.8 71.6,78.58 v71.12,78.11 | U$8.11 83.7,74.29 v84.12,73.86 | U$7.9 93.89,78.44 v93.45,78.59 | v61.98,69.85 65.53,69.85 v66.42,68.96 66.42,67.82 v65.15,66.55
SCL_
  Top 0.305: U$1.5 72.02,49.35 R27.2 71.75,49.07 71.37,49.07 70.31,48.01 R55.2
SCL_BMS  (via drill 0.38)
  Top 0.305: U$10.4 34.77,39.21 35.56,40.01 35.56,45.09 38.1,47.62 60.14,47.62 | 60.14,47.62 R56.1 | SP4.P$2 89.66,33.78 v87.12,36.32 | v69.09,44.7 62.23,44.7 60.45,46.48 60.45,47.31 60.14,47.62
  Bottom 0.305: v87.12,36.32 87.12,36.07 86.11,35.05 78.74,35.05 v69.09,44.7
SDA  (via drill 0.38 pad 0.3)
  Top 0.305: U$2.15 28.04,64.83 28.04,60.91 27.23,60.1 R2.1 26.67,60.03 26.67,59.05 25.27,57.66 | U$17.2 3.17,47.62 6.35,50.8 6.35,53.98 9.53,57.15 24.77,57.15 25.27,57.66 | v71.12,76.83 69.85,76.83 68.58,75.56 68.58,73.03 66.1,70.55 | v83.19,73.03 83.19,71.75 81.98,70.55 66.1,70.55 | v92.58,79.25 92.58,71.88 89.09,67.88 63.44,67.88 | 66.1,70.55 63.44,67.88 | 63.44,67.88 46.86,51.31 32,51.31 25.65,57.66 25.27,57.66
  Bottom 0.305: U$14.7 71.62,77.33 v71.12,76.83 | U$8.12 83.2,74.31 v83.19,73.03 | U$7.10 95.76,79.12 95.5,79.38 93.22,79.38 v92.58,79.25
SDA_
  Top 0.305: U$1.4 73.45,50 72.95,50.49 70.24,50.49 R26.2 69.78,50.04 R54.2
SDA_BMS  (via drill 0.38)
  Top 0.305: U$10.3 34,39.71 34.92,40.64 34.92,45.72 37.47,48.26 57.15,48.26 59.05,50.16 60.39,50.16 R57.1 61.38,51.31 v64.11,51.31 | SP3.P$2 87.12,34.54 v85.09,36.58 | v70.36,45.72 66.04,45.72 v65.02,46.74
  Bottom 0.305: v85.09,36.58 85.09,36.83 78.99,42.93 73.15,42.93 v70.36,45.72 | v65.02,46.74 65.02,50.29 v64.11,51.31
SMBC  (via drill 0.38, 0.38 pad 0.3)
  Top 0.305: R50.2 19.68,31.31 v19.68,29.84 | U$16.1 2.86,49.84 v3.17,49.53 | v8.89,33.66 8.89,27.3 v11.43,24.77 13.84,22.35 v45.97,22.35 | SP6.P$2 85.19,21.23 v84.84,21.59
  Bottom 0.305: v19.68,29.84 14.61,24.77 v11.43,24.77 | v3.17,49.53 3.17,44.45 8.26,39.37 8.26,34.29 v8.89,33.66 | v84.84,21.59 77.98,28.45 76.2,28.45 75.95,28.19 75.95,21.84 75.69,21.59 69.85,21.59 69.09,22.35 v45.97,22.35
SMBD  (via drill 0.38)
  Top 0.305: R51.2 18.09,37.78 17.78,37.47 17.78,36.2 16.51,34.92 13.97,34.92 | U$17.1 2.23,39.69 3.17,38.73 3.2,38.73 3.2,35.53 3.81,34.92 13.97,34.92 | SP5.P$1 86.97,21.23 v85.09,23.11 | v46.48,23.37 17.53,23.37 13.46,27.43 13.46,34.42 13.97,34.92
  Bottom 0.305: v46.48,23.37 70.87,23.37 71.88,22.35 74.42,22.35 75.18,23.11 74.93,23.37 74.93,30.23 79.76,30.23 85.09,24.89 v85.09,23.11
VBAT  (via drill 0.38 pad 0.3)
  Top 0.305: 39.37,55.78 39.62,55.78 40.07,56.22 U$4.3 41.5,57.37 43.18,59.05 43.18,60.26 C1.1 | 39.37,55.78 38.71,55.78 38.25,56.24 38.25,57.29 U$4.1 | U$5.3 23.14,78.38 24.13,78.87 40.64,78.87 v42.55,77.47 | v40.64,55.24 39.9,55.24 39.37,55.78
  Bottom 0.305: v42.55,77.47 42.55,57.15 v40.64,55.24
VBUS  (via drill 0.38 pad 0.3)
  Top 0.203: R4.1 1.63,59.84 2.54,58.93 7.62,58.93 11.18,62.48 11.18,64.77 13.21,66.8 13.21,68.83 12.19,69.85 11.43,69.85 11.18,69.6 11.18,68.58 10.16,67.56 8.64,67.56 v8.26,67.94
  Top 0.305: U$13.4 6.92,66.61 v8.26,67.94 | v5.08,74.93 6.86,74.93 7.62,75.69 8.75,75.69 U$6.1
  Bottom 0.305: v8.26,67.94 1.91,67.94 0.64,69.22 0.64,73.66 1.91,74.93 v5.08,74.93
VC0
  Top 0.305: U$1.17 83.07,49.99 84.33,49.99 85.6,51.26 C20.2 86.53,52.49 86.87,52.83 86.87,55.12 87.63,55.88 88.39,55.88 89.15,55.12 89.76,55.12 R11.1
VC1
  Top 0.305: U$1.16 85.35,49.35 85.79,49.78 87.88,49.78 88.39,50.29 C16.2 | 88.27,50.36 C16.2 | C16.2 89.7,50.48 R12.1 | C16.2 C15.2
VC2
  Top 0.305: C16.1 88.58,48.58 88.9,48.26 | C17.2 C16.1 | C16.1 90.34,48.58 R13.1 | U$1.15 88.28,48.7 C16.1
VC3
  Top 0.305: R14.1 90.3,46.48 88.9,45.09 88.71,45.09 C17.1 | U$1.14 83.07,48.06 85.34,48.06 87,46.41 87,45.09 87.31,44.77 C17.1 | C18.2 88.39,43.58 C17.1
VC4
  Top 0.305: C19.2 88.52,40.89 88.27,40.64 | U$1.13 84.68,47.4 86.36,45.72 86.36,44.45 86.02,44.11 C18.1 86.02,42.81 86.82,42.01 87.46,42.01 C19.2 | C19.2 89.31,41.62 89.31,43.13 90.12,43.94 R15.1
VC5  (via drill 0.3 pad 0.3, 0.38 pad 0.3)
  Top 0.305: C19.1 85.47,40.89 v85.09,41.27 84.45,41.91 84.45,46.25 83.97,46.74 83.08,46.74 U$1.12 | v92.08,40.01 92.08,40.11 R16.1
  Bottom 0.305: v85.09,41.27 85.72,40.64 91.44,40.64 v92.08,40.01
VCC  (via drill 0.38 pad 0.3)
  Top 0.203: 25.3,62.23 25.3,59.21 v24.77,58.67 | U$3.9 35.81,75.95 37.34,77.47 40.39,77.47 43.18,74.68 44.7,74.68 v45.09,74.3
  Top 0.305: R6.2 24.79,62.74 25.3,62.23 25.3,61.48 R1.2 R2.2 | U$11.2 48.77,76.71 48.79,74.85 48.28,74.3 v45.09,74.3
  Bottom 0.305: U$11.2 48.77,78.61 49.53,79.38 60.96,79.38 61.59,78.74 U$12.2 | v24.77,58.67 32.51,58.67 37.59,54.23 43.94,54.23 46.99,56.9 46.99,65.91 44.32,68.58 44.32,73.79 v45.09,74.3
VCC_SENSOR  (via drill 0.38 pad 0.3)
  Top 0.305: v60.2,76.07 66.29,76.07 67.82,77.6 67.82,78.74 67.31,79.25 66.55,79.25 v66.42,79.38 | v84.33,77.6 85.98,79.25 v87.38,79.25 | v91.19,76.45 91.57,76.45 91.57,73.41 91.69,73.15 v91.82,72.77
  Bottom 0.203: U$8.18 76.95,77.96
  Bottom 0.305: C10.1 C11.1 69.23,78.75 69.72,79.25 | 76.83,77.85 76.83,78.11 76.36,78.58 U$14.1 73.49,79.5 69.98,79.5 69.72,79.25 | 76.83,77.85 76.83,75.56 76.2,74.93 74.5,74.93 U$14.4 | U$8.17 U$8.18 82.79,77.6 v84.33,77.6 84.33,76.71 84.07,76.45 U$8.15 82.42,76.45 81.41,76.45 79.23,74.28 C8.1 | U$7.1 97.03,78.62 97.16,78.74 98.19,78.74 C5.1 98.92,78.74 99.06,78.74 99.69,78.11 99.69,76.2 99.06,75.56 95.89,75.56 95.76,75.69 U$7.5 95.76,74.31 C4.1 95.89,74.18 95.89,73.53 95.12,72.77 v91.82,72.77 | 76.95,77.96 76.83,77.85 | U$12.3 59.59,76.68 v60.2,76.07 | v66.42,79.38 66.67,79.38 66.8,79.5 69.47,79.5 69.72,79.25 | 88.01,78.49 89.14,78.49 R7.2 89.76,78.63 C9.1 90.81,76.83 v91.19,76.45 | 88.01,78.49 87.88,78.49 88.01,78.11 88.01,75.82 88.39,75.44 C7.1 | v87.38,79.25 88.01,78.61 88.01,78.49

### Text on the board
tPlace: POWER | CHARGING | BMS | BATT | SENSORS ON | RESET | LED DISPLAY | BAT+ | LOAD+ | BAT- | LOAD- | CHG+ | CHG-